# EAGLE design MLX90393_breakout1_short2 (EAGLE 6.5.0)
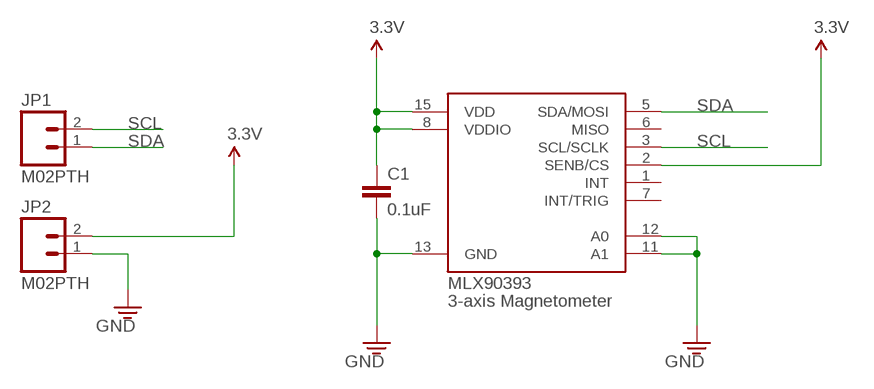
[diagram p0: schematic, sheet 1]

## Parts
C1  0.1uF  CAP0603  [0603]
JP1  M02PTH  [1X02]
JP2  M02PTH  [1X02]
U$1  MLX90393  [16-QFN]

## Nets
3.3V: C1.1 JP2.2 U$1.2(SENB/CS) U$1.8(VDDIO) U$1.15(VDD)
GND: C1.2 JP2.1 U$1.11(A1) U$1.12(A0) U$1.13(GND)
SCL: JP1.2 U$1.3(SCL/SCLK)
SDA: JP1.1 U$1.5(SDA/MOSI)
Unconnected: U$1.1(INT) U$1.6(MISO) U$1.7(INT/TRIG)

## Library data of the parts
C1 = lowfieldmri:CAP: Capacitor Standard 0603 ceramic capacitor, and 0.1" leaded capacitor.
JP1 JP2 = SparkFun-Connectors:M02: Standard 2-pin 0.1" header. Use with - straight break away headers ( PRT-00116) - right angle break away headers (PRT-00553) - swiss pins (PRT-00743) - machine pins (PRT-00117) - female headers (PRT-00115) Molex polarized connector foot print use with: PRT-08233 with associated crimp pins and housings. 2.54_SCREWTERM for use with PRT-10571. 3.5mm Screw Terminal footprints for PRT-08084 5mm Screw Terminal footprints for use with PRT-08433
U$1 = lowfieldmri:MLX90393: Melexis MLX90393 3-axis magnetometer

## Board
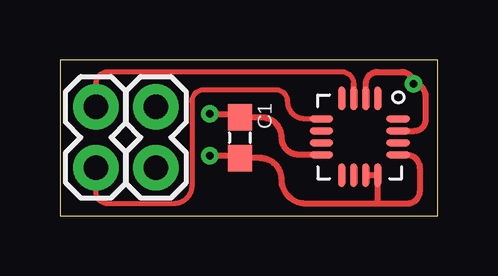
[diagram p1: board, top side]
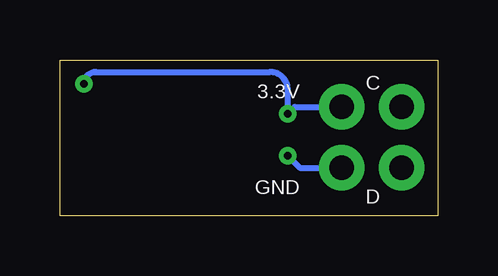
[diagram p2: board, bottom side, seen from below]

Size 15.75 x 6.5 mm. Coordinates in mm from the lower left corner, seen from the top.
Outline: 0,6.5 0,0 15.75,0 15.75,6.5 0,6.5
Copper layers (1*16): Top 0.035mm / dielectric 1.5mm / Bottom 0.035mm
Design rules "default": minimum track width 10mil, minimum drill 24mil, track to track 8mil, track to pad 8mil, pad to pad 8mil, via to via 8mil, smd to smd 8mil, copper to edge 40mil, drill to drill 8mil, minimum pad ring 10mil, minimum via ring 8mil, stop-mask expansion 4mil, vias tented up to drill 0mil, thermal gap 10mil

### Footprints (pad centres in the part's own frame; a part is rotated, then mirrored left to right if it is on the bottom)
0603 = smd 1.1 x 1: 1 -0.85,0; 2 0.85,0
1X02 = drill 1.016 pad 1.88: 1 0,0; 2 2.54,0
16-QFN = smd 0.3 x 1: 1 0.75,1.6; 2 0.25,1.6; 3 -0.25,1.6; 4 -0.75,1.6; 9 -0.75,-1.6; 10 -0.25,-1.6; 11 0.25,-1.6; 12 0.75,-1.6 | smd 1 x 0.3: 5 -1.6,0.75; 6 -1.6,0.25; 7 -1.6,-0.25; 8 -1.6,-0.75; 13 1.6,-0.75; 14 1.6,-0.25; 15 1.6,0.25; 16 1.6,0.75

### Placement (x,y rotation side)
C1  7.5,3.25 270 top
JP1  1.5,2 90 top
JP2  4,2 90 top
U$1  12.51,3.29 0 top

### Tracks (layer width: path | path; a pad name or v marks a point on that pad's centre or on a via)
3.3V  (via drill 0.33)
  Top 0.254: U$1.8 9.96,2.54 arc-90 9.25,3.25 arc90 8.4,4.1 C1.1 7.5,4.25 v6.25,4.25 | U$1.2 12.76,5.51 arc-90 13.25,6 14.25,6 arc-90 v14.75,5.5 arc-90 15.25,5 15.25,4 arc-90 14.79,3.54 U$1.15
  Bottom 0.254: v14.75,5.5 arc90 14.25,6 7,6 arc90 6.25,5.25 v6.25,4.25 5.96,4.54 JP2.2
GND  (via drill 0.33)
  Top 0.254: U$1.13 14.46,2.54 arc-90 15,2 15,1 arc-90 14.5,0.5 13.26,0.5 | 13.26,0.5 10.25,0.5 arc-90 9.25,1.5 arc90 8.35,2.4 C1.2 7.4,2.5 v6.25,2.5 | U$1.11 U$1.12 13.26,0.5
  Bottom 0.254: v6.25,2.5 5.75,2 JP2.1
SCL
  Top 0.203: 12.26,5.49 arc90 11.75,6 2,6 arc90 1.5,5.5 JP1.2
  Top 0.254: U$1.3 12.26,5.49
SDA
  Top 0.203: U$1.5 10.21,4.04 arc-90 9.5,4.75 arc90 9,5.25 6,5.25 arc90 5.5,4.75 5.5,1.25 arc-90 4.75,0.5 2,0.5 arc-90 1.5,1 JP1.1

### Text on the board
bPlace: C | 3.3V | GND | D